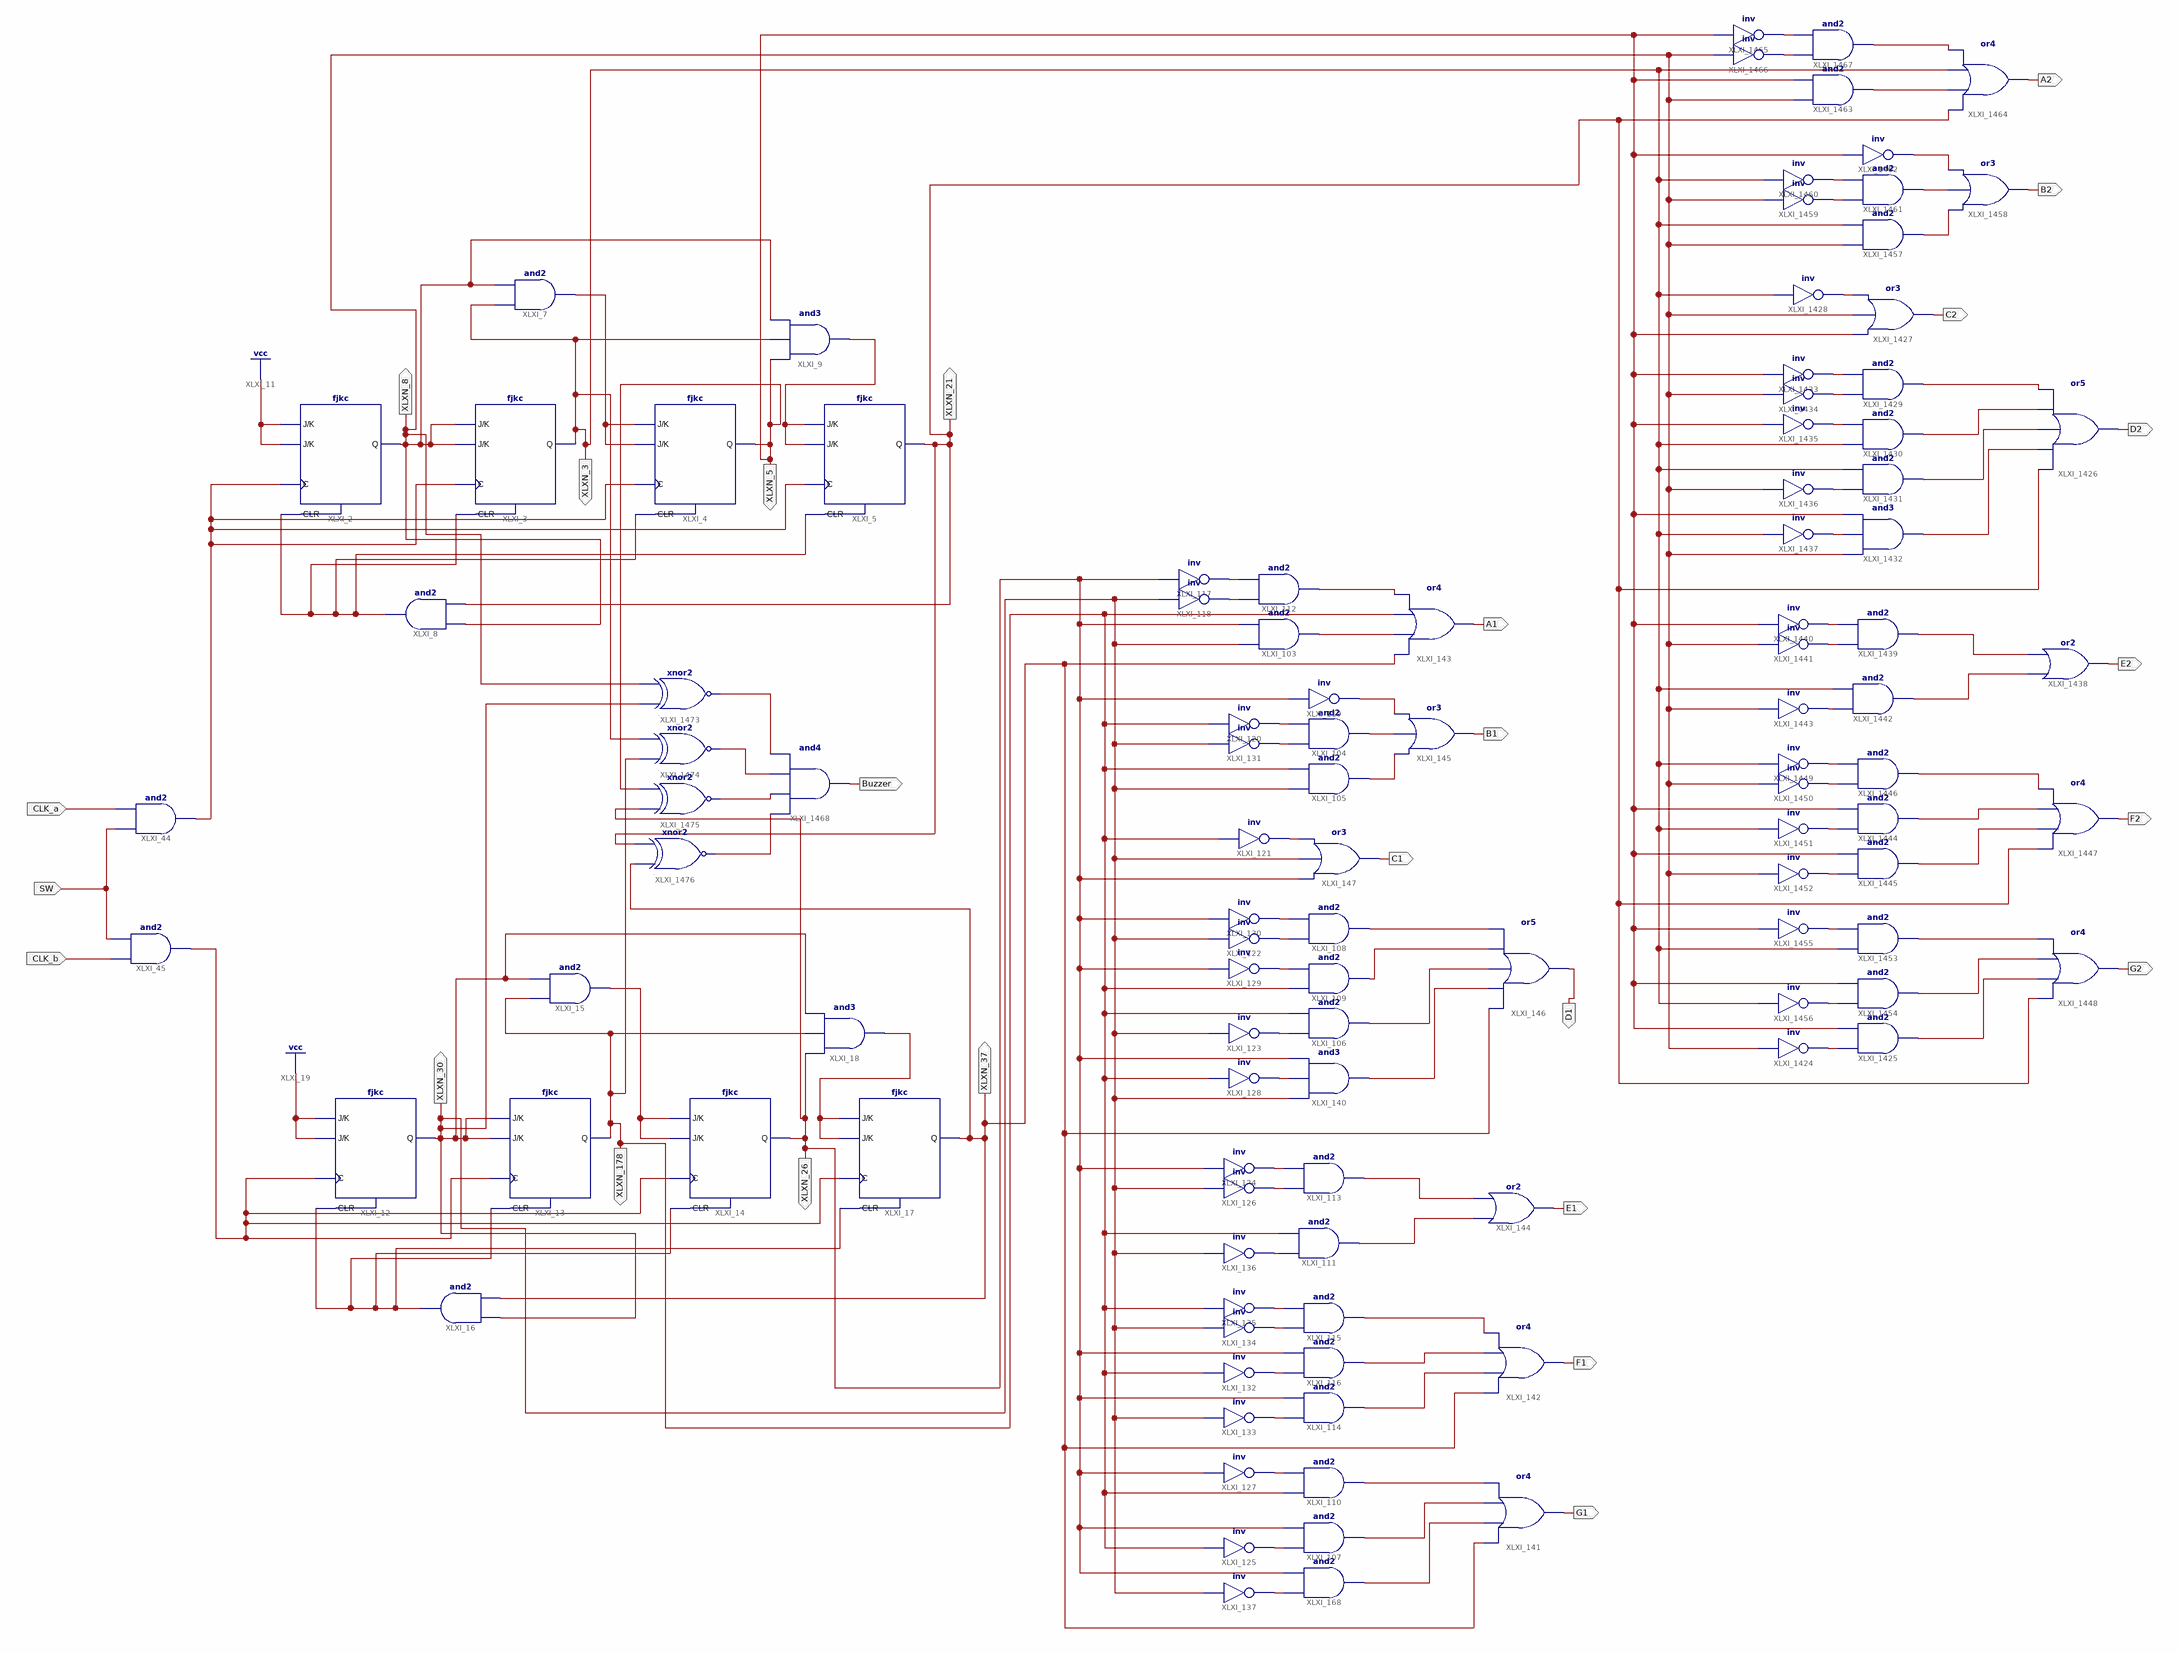
[diagram p0: schematic sheet 1]
// Xilinx ISE schematic newtest.sch (spartan6) as structural Verilog: 109 symbols, 26 ports
module newtest (
  input  SW,
  input  CLK_a,
  input  CLK_b,
  output XLXN_3,
  output XLXN_5,
  output XLXN_21,
  output XLXN_26,
  output XLXN_37,
  output XLXN_30,
  output XLXN_178,
  output XLXN_8,
  output A1,
  output B1,
  output C1,
  output D1,
  output E1,
  output F1,
  output G1,
  output A2,
  output B2,
  output C2,
  output D2,
  output E2,
  output F2,
  output G2,
  output Buzzer
);

  wire XLXN_1, XLXN_18, XLXN_19, XLXN_24, XLXN_33, XLXN_35, XLXN_179, XLXN_180, XLXN_181, XLXN_183, XLXN_187,
       XLXN_188, XLXN_189, XLXN_190, XLXN_191, XLXN_197, XLXN_205, XLXN_206, XLXN_207, XLXN_208, XLXN_209,
       XLXN_211, XLXN_212, XLXN_213, XLXN_214, XLXN_215, XLXN_218, XLXN_219, XLXN_222, XLXN_223, XLXN_224,
       XLXN_225, XLXN_226, XLXN_227, XLXN_228, XLXN_229, XLXN_230, XLXN_233, XLXN_234, XLXN_235, XLXN_236,
       XLXN_237, XLXN_238, XLXN_1741, XLXN_1742, XLXN_1743, XLXN_1744, XLXN_1745, XLXN_1746, XLXN_1747,
       XLXN_1748, XLXN_1749, XLXN_1750, XLXN_1751, XLXN_1752, XLXN_1753, XLXN_1754, XLXN_1755, XLXN_1756,
       XLXN_1757, XLXN_1758, XLXN_1759, XLXN_1760, XLXN_1761, XLXN_1762, XLXN_1763, XLXN_1764, XLXN_1765,
       XLXN_1766, XLXN_1767, XLXN_1768, XLXN_1769, XLXN_1770, XLXN_1771, XLXN_1772, XLXN_1773, XLXN_1774,
       XLXN_1775, XLXN_1776, XLXN_1777, XLXN_1787, XLXN_1788, XLXN_1789, XLXN_1790, XLXN_1794, XLXN_1795;

  fjkc XLXI_2 (.C(XLXN_18), .CLR(XLXN_1795), .J(1'b1), .K(1'b1), .Q(XLXN_8));
  fjkc XLXI_3 (.C(XLXN_18), .CLR(XLXN_1795), .J(XLXN_8), .K(XLXN_8), .Q(XLXN_3));
  fjkc XLXI_4 (.C(XLXN_18), .CLR(XLXN_1795), .J(XLXN_1), .K(XLXN_1), .Q(XLXN_5));
  and XLXI_7 (XLXN_1, XLXN_3, XLXN_8);
  and XLXI_8 (XLXN_1795, XLXN_21, XLXN_8);
  fjkc XLXI_5 (.C(XLXN_18), .CLR(XLXN_1795), .J(XLXN_19), .K(XLXN_19), .Q(XLXN_21));
  and XLXI_9 (XLXN_19, XLXN_5, XLXN_3, XLXN_8);
  and XLXI_44 (XLXN_18, SW, CLK_a);
  and XLXI_45 (XLXN_33, CLK_b, SW);
  fjkc XLXI_12 (.C(XLXN_33), .CLR(XLXN_1794), .J(1'b1), .K(1'b1), .Q(XLXN_30));
  fjkc XLXI_14 (.C(XLXN_33), .CLR(XLXN_1794), .J(XLXN_24), .K(XLXN_24), .Q(XLXN_26));
  and XLXI_15 (XLXN_24, XLXN_178, XLXN_30);
  and XLXI_16 (XLXN_1794, XLXN_37, XLXN_30);
  fjkc XLXI_17 (.C(XLXN_33), .CLR(XLXN_1794), .J(XLXN_35), .K(XLXN_35), .Q(XLXN_37));
  and XLXI_18 (XLXN_35, XLXN_26, XLXN_178, XLXN_30);
  fjkc XLXI_13 (.C(XLXN_33), .CLR(XLXN_1794), .J(XLXN_30), .K(XLXN_30), .Q(XLXN_178));
  not XLXI_137 (XLXN_235, XLXN_30);
  and XLXI_168 (XLXN_238, XLXN_235, XLXN_26);
  or XLXI_146 (D1, XLXN_37, XLXN_209, XLXN_208, XLXN_207, XLXN_206);
  or XLXI_147 (C1, XLXN_26, XLXN_30, XLXN_197);
  not XLXI_121 (XLXN_197, XLXN_178);
  and XLXI_108 (XLXN_206, XLXN_212, XLXN_211);
  and XLXI_109 (XLXN_207, XLXN_178, XLXN_213);
  and XLXI_106 (XLXN_208, XLXN_214, XLXN_178);
  and XLXI_140 (XLXN_209, XLXN_30, XLXN_215, XLXN_26);
  not XLXI_130 (XLXN_211, XLXN_26);
  not XLXI_122 (XLXN_212, XLXN_30);
  not XLXI_129 (XLXN_213, XLXN_26);
  not XLXI_123 (XLXN_214, XLXN_30);
  not XLXI_128 (XLXN_215, XLXN_178);
  or XLXI_144 (E1, XLXN_223, XLXN_222);
  and XLXI_113 (XLXN_222, XLXN_219, XLXN_218);
  not XLXI_124 (XLXN_218, XLXN_26);
  not XLXI_126 (XLXN_219, XLXN_30);
  and XLXI_111 (XLXN_223, XLXN_205, XLXN_178);
  not XLXI_136 (XLXN_205, XLXN_30);
  and XLXI_116 (XLXN_229, XLXN_226, XLXN_26);
  and XLXI_114 (XLXN_230, XLXN_227, XLXN_26);
  and XLXI_115 (XLXN_228, XLXN_225, XLXN_224);
  or XLXI_142 (F1, XLXN_37, XLXN_230, XLXN_229, XLXN_228);
  or XLXI_141 (G1, XLXN_37, XLXN_238, XLXN_237, XLXN_236);
  not XLXI_135 (XLXN_224, XLXN_178);
  not XLXI_134 (XLXN_225, XLXN_30);
  not XLXI_132 (XLXN_226, XLXN_178);
  not XLXI_133 (XLXN_227, XLXN_30);
  and XLXI_110 (XLXN_236, XLXN_178, XLXN_233);
  and XLXI_107 (XLXN_237, XLXN_234, XLXN_26);
  not XLXI_127 (XLXN_233, XLXN_26);
  not XLXI_125 (XLXN_234, XLXN_178);
  and XLXI_105 (XLXN_191, XLXN_30, XLXN_178);
  or XLXI_145 (B1, XLXN_191, XLXN_190, XLXN_189);
  not XLXI_131 (XLXN_188, XLXN_30);
  not XLXI_120 (XLXN_187, XLXN_178);
  and XLXI_104 (XLXN_190, XLXN_188, XLXN_187);
  not XLXI_119 (XLXN_189, XLXN_26);
  and XLXI_103 (XLXN_183, XLXN_30, XLXN_26);
  or XLXI_143 (A1, XLXN_37, XLXN_183, XLXN_178, XLXN_181);
  not XLXI_117 (XLXN_180, XLXN_26);
  not XLXI_118 (XLXN_179, XLXN_30);
  and XLXI_112 (XLXN_181, XLXN_179, XLXN_180);
  not XLXI_1424 (XLXN_1765, XLXN_8);
  and XLXI_1425 (XLXN_1768, XLXN_1765, XLXN_5);
  or XLXI_1426 (D2, XLXN_21, XLXN_1745, XLXN_1744, XLXN_1743, XLXN_1742);
  or XLXI_1427 (C2, XLXN_5, XLXN_8, XLXN_1741);
  not XLXI_1428 (XLXN_1741, XLXN_3);
  and XLXI_1429 (XLXN_1742, XLXN_1747, XLXN_1746);
  and XLXI_1430 (XLXN_1743, XLXN_3, XLXN_1748);
  and XLXI_1431 (XLXN_1744, XLXN_1749, XLXN_3);
  and XLXI_1432 (XLXN_1745, XLXN_8, XLXN_1750, XLXN_5);
  not XLXI_1433 (XLXN_1746, XLXN_5);
  not XLXI_1434 (XLXN_1747, XLXN_8);
  not XLXI_1435 (XLXN_1748, XLXN_5);
  not XLXI_1436 (XLXN_1749, XLXN_8);
  not XLXI_1437 (XLXN_1750, XLXN_3);
  or XLXI_1438 (E2, XLXN_1755, XLXN_1754);
  and XLXI_1439 (XLXN_1754, XLXN_1752, XLXN_1751);
  not XLXI_1440 (XLXN_1751, XLXN_5);
  not XLXI_1441 (XLXN_1752, XLXN_8);
  and XLXI_1442 (XLXN_1755, XLXN_1753, XLXN_3);
  not XLXI_1443 (XLXN_1753, XLXN_8);
  and XLXI_1444 (XLXN_1761, XLXN_1758, XLXN_5);
  and XLXI_1445 (XLXN_1762, XLXN_1759, XLXN_5);
  and XLXI_1446 (XLXN_1760, XLXN_1757, XLXN_1756);
  or XLXI_1447 (F2, XLXN_21, XLXN_1762, XLXN_1761, XLXN_1760);
  or XLXI_1448 (G2, XLXN_21, XLXN_1768, XLXN_1767, XLXN_1766);
  not XLXI_1449 (XLXN_1756, XLXN_3);
  not XLXI_1450 (XLXN_1757, XLXN_8);
  not XLXI_1451 (XLXN_1758, XLXN_3);
  not XLXI_1452 (XLXN_1759, XLXN_8);
  and XLXI_1453 (XLXN_1766, XLXN_3, XLXN_1763);
  and XLXI_1454 (XLXN_1767, XLXN_1764, XLXN_5);
  not XLXI_1455 (XLXN_1763, XLXN_5);
  not XLXI_1456 (XLXN_1764, XLXN_3);
  and XLXI_1457 (XLXN_1769, XLXN_8, XLXN_3);
  or XLXI_1458 (B2, XLXN_1769, XLXN_1770, XLXN_1771);
  not XLXI_1459 (XLXN_1772, XLXN_8);
  not XLXI_1460 (XLXN_1773, XLXN_3);
  and XLXI_1461 (XLXN_1770, XLXN_1772, XLXN_1773);
  not XLXI_1462 (XLXN_1771, XLXN_5);
  and XLXI_1463 (XLXN_1774, XLXN_8, XLXN_5);
  or XLXI_1464 (A2, XLXN_21, XLXN_1774, XLXN_3, XLXN_1775);
  not XLXI_1465 (XLXN_1776, XLXN_5);
  not XLXI_1466 (XLXN_1777, XLXN_8);
  and XLXI_1467 (XLXN_1775, XLXN_1777, XLXN_1776);
  and XLXI_1468 (Buzzer, XLXN_1790, XLXN_1789, XLXN_1788, XLXN_1787);
  xnor XLXI_1473 (XLXN_1787, XLXN_30, XLXN_8);
  xnor XLXI_1474 (XLXN_1788, XLXN_178, XLXN_3);
  xnor XLXI_1475 (XLXN_1789, XLXN_26, XLXN_5);
  xnor XLXI_1476 (XLXN_1790, XLXN_37, XLXN_21);
endmodule
